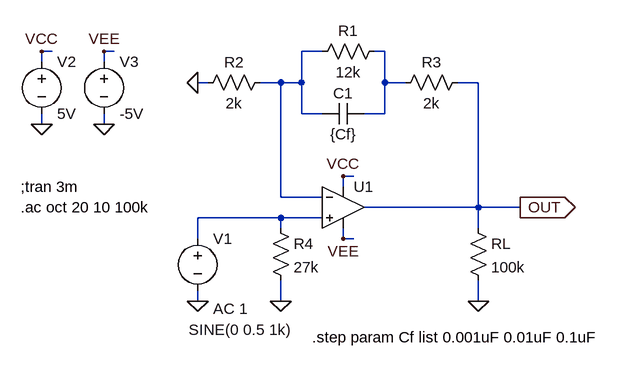
[diagram p0: schematic NegativeFeedback_LowBoost_OPAMP_DualPWR.asc]
NegativeFeedback_LowBoost_OPAMP_DualPWR.asc, the LTspice schematic file:
Version 4
SHEET 1 880 680
WIRE -224 -80 -240 -80
WIRE -128 -80 -144 -80
WIRE 192 -80 160 -80
WIRE 288 -80 272 -80
WIRE -240 -64 -240 -80
WIRE -144 -64 -144 -80
WIRE 16 -32 0 -32
WIRE 128 -32 96 -32
WIRE 160 -32 160 -80
WIRE 160 -32 128 -32
WIRE 288 -32 288 -80
WIRE 320 -32 288 -32
WIRE 432 -32 400 -32
WIRE 160 16 160 -32
WIRE 192 16 160 16
WIRE 288 16 288 -32
WIRE 288 16 256 16
WIRE -240 32 -240 16
WIRE -144 32 -144 16
WIRE 240 112 224 112
WIRE 224 128 224 112
WIRE 128 144 128 -32
WIRE 192 144 128 144
WIRE 432 160 432 -32
WIRE 432 160 256 160
WIRE 496 160 432 160
WIRE 128 176 0 176
WIRE 192 176 128 176
WIRE 128 192 128 176
WIRE 432 192 432 160
WIRE 0 208 0 176
WIRE 224 208 224 192
WIRE 240 208 224 208
WIRE 0 304 0 288
WIRE 128 304 128 272
WIRE 432 304 432 272
FLAG 224 112 VCC
FLAG 224 208 VEE
FLAG 496 160 OUT
IOPIN 496 160 Out
FLAG 0 304 0
FLAG 432 304 0
FLAG -240 32 0
FLAG -144 32 0
FLAG -240 -80 VCC
FLAG -144 -80 VEE
FLAG 0 -32 0
FLAG 128 304 0
SYMBOL Opamps\\UniversalOpamp2 224 160 R0
SYMATTR InstName U1
SYMBOL voltage 0 192 R0
WINDOW 123 24 124 Left 2
WINDOW 39 0 0 Left 2
WINDOW 3 -14 156 Left 2
SYMATTR Value2 AC 1
SYMATTR InstName V1
SYMATTR Value SINE(0 0.5 1k)
SYMBOL res 288 -96 R90
WINDOW 0 0 56 VBottom 2
WINDOW 3 32 56 VTop 2
SYMATTR InstName R1
SYMATTR Value 12k
SYMBOL cap 256 0 R90
WINDOW 0 0 32 VBottom 2
WINDOW 3 32 32 VTop 2
SYMATTR InstName C1
SYMATTR Value {Cf}
SYMBOL res 416 176 R0
SYMATTR InstName RL
SYMATTR Value 100k
SYMBOL voltage -240 -80 R0
WINDOW 123 0 0 Left 2
WINDOW 39 0 0 Left 2
SYMATTR InstName V2
SYMATTR Value 5V
SYMBOL voltage -144 -80 R0
WINDOW 123 0 0 Left 2
WINDOW 39 0 0 Left 2
SYMATTR InstName V3
SYMATTR Value -5V
SYMBOL res 112 -48 R90
WINDOW 0 0 56 VBottom 2
WINDOW 3 32 56 VTop 2
SYMATTR InstName R2
SYMATTR Value 2k
SYMBOL res 416 -48 R90
WINDOW 0 0 56 VBottom 2
WINDOW 3 32 56 VTop 2
SYMATTR InstName R3
SYMATTR Value 2k
SYMBOL res 112 176 R0
SYMATTR InstName R4
SYMATTR Value 27k
TEXT -272 128 Left 2 !;tran 3m
TEXT -272 160 Left 2 !.ac oct 20 10 100k
TEXT 176 360 Left 2 !.step param Cf list 0.001uF 0.01uF 0.1uF

The netlist it stands for:
* NegativeFeedback_LowBoost_OPAMP_DualPWR.asc
XU1 N003 N001 VCC VEE OUT level.2 Avol=1Meg GBW=10Meg Slew=10Meg ilimit=25m rail=0 Vos=0 phimargin=45 en=0 enk=0 in=0 ink=0 Rin=500Meg  ; pins IN+ IN- V+ V- OUT
V1 N003 0 SINE(0 0.5 1k) AC 1
R1 N002 N001 12k
C1 N002 N001 {Cf}
RL OUT 0 100k
V2 VCC 0 5V
V3 VEE 0 -5V
R2 N001 0 2k
R3 OUT N002 2k
R4 N003 0 27k
;tran 3m
.ac oct 20 10 100k
.step param Cf list 0.001uF 0.01uF 0.1uF
.lib UniversalOpamps2.sub
.backanno
.end